# EasyEDA schematic SCH_Satlla_4_rpi_board_2023-01-29.json
TITLE: Solar_Unit_110x50; REV: 1.0; Date: 2021-01-31; Sheet: 1/1; Drawn By: KCG LAB; Company: KCG LAB
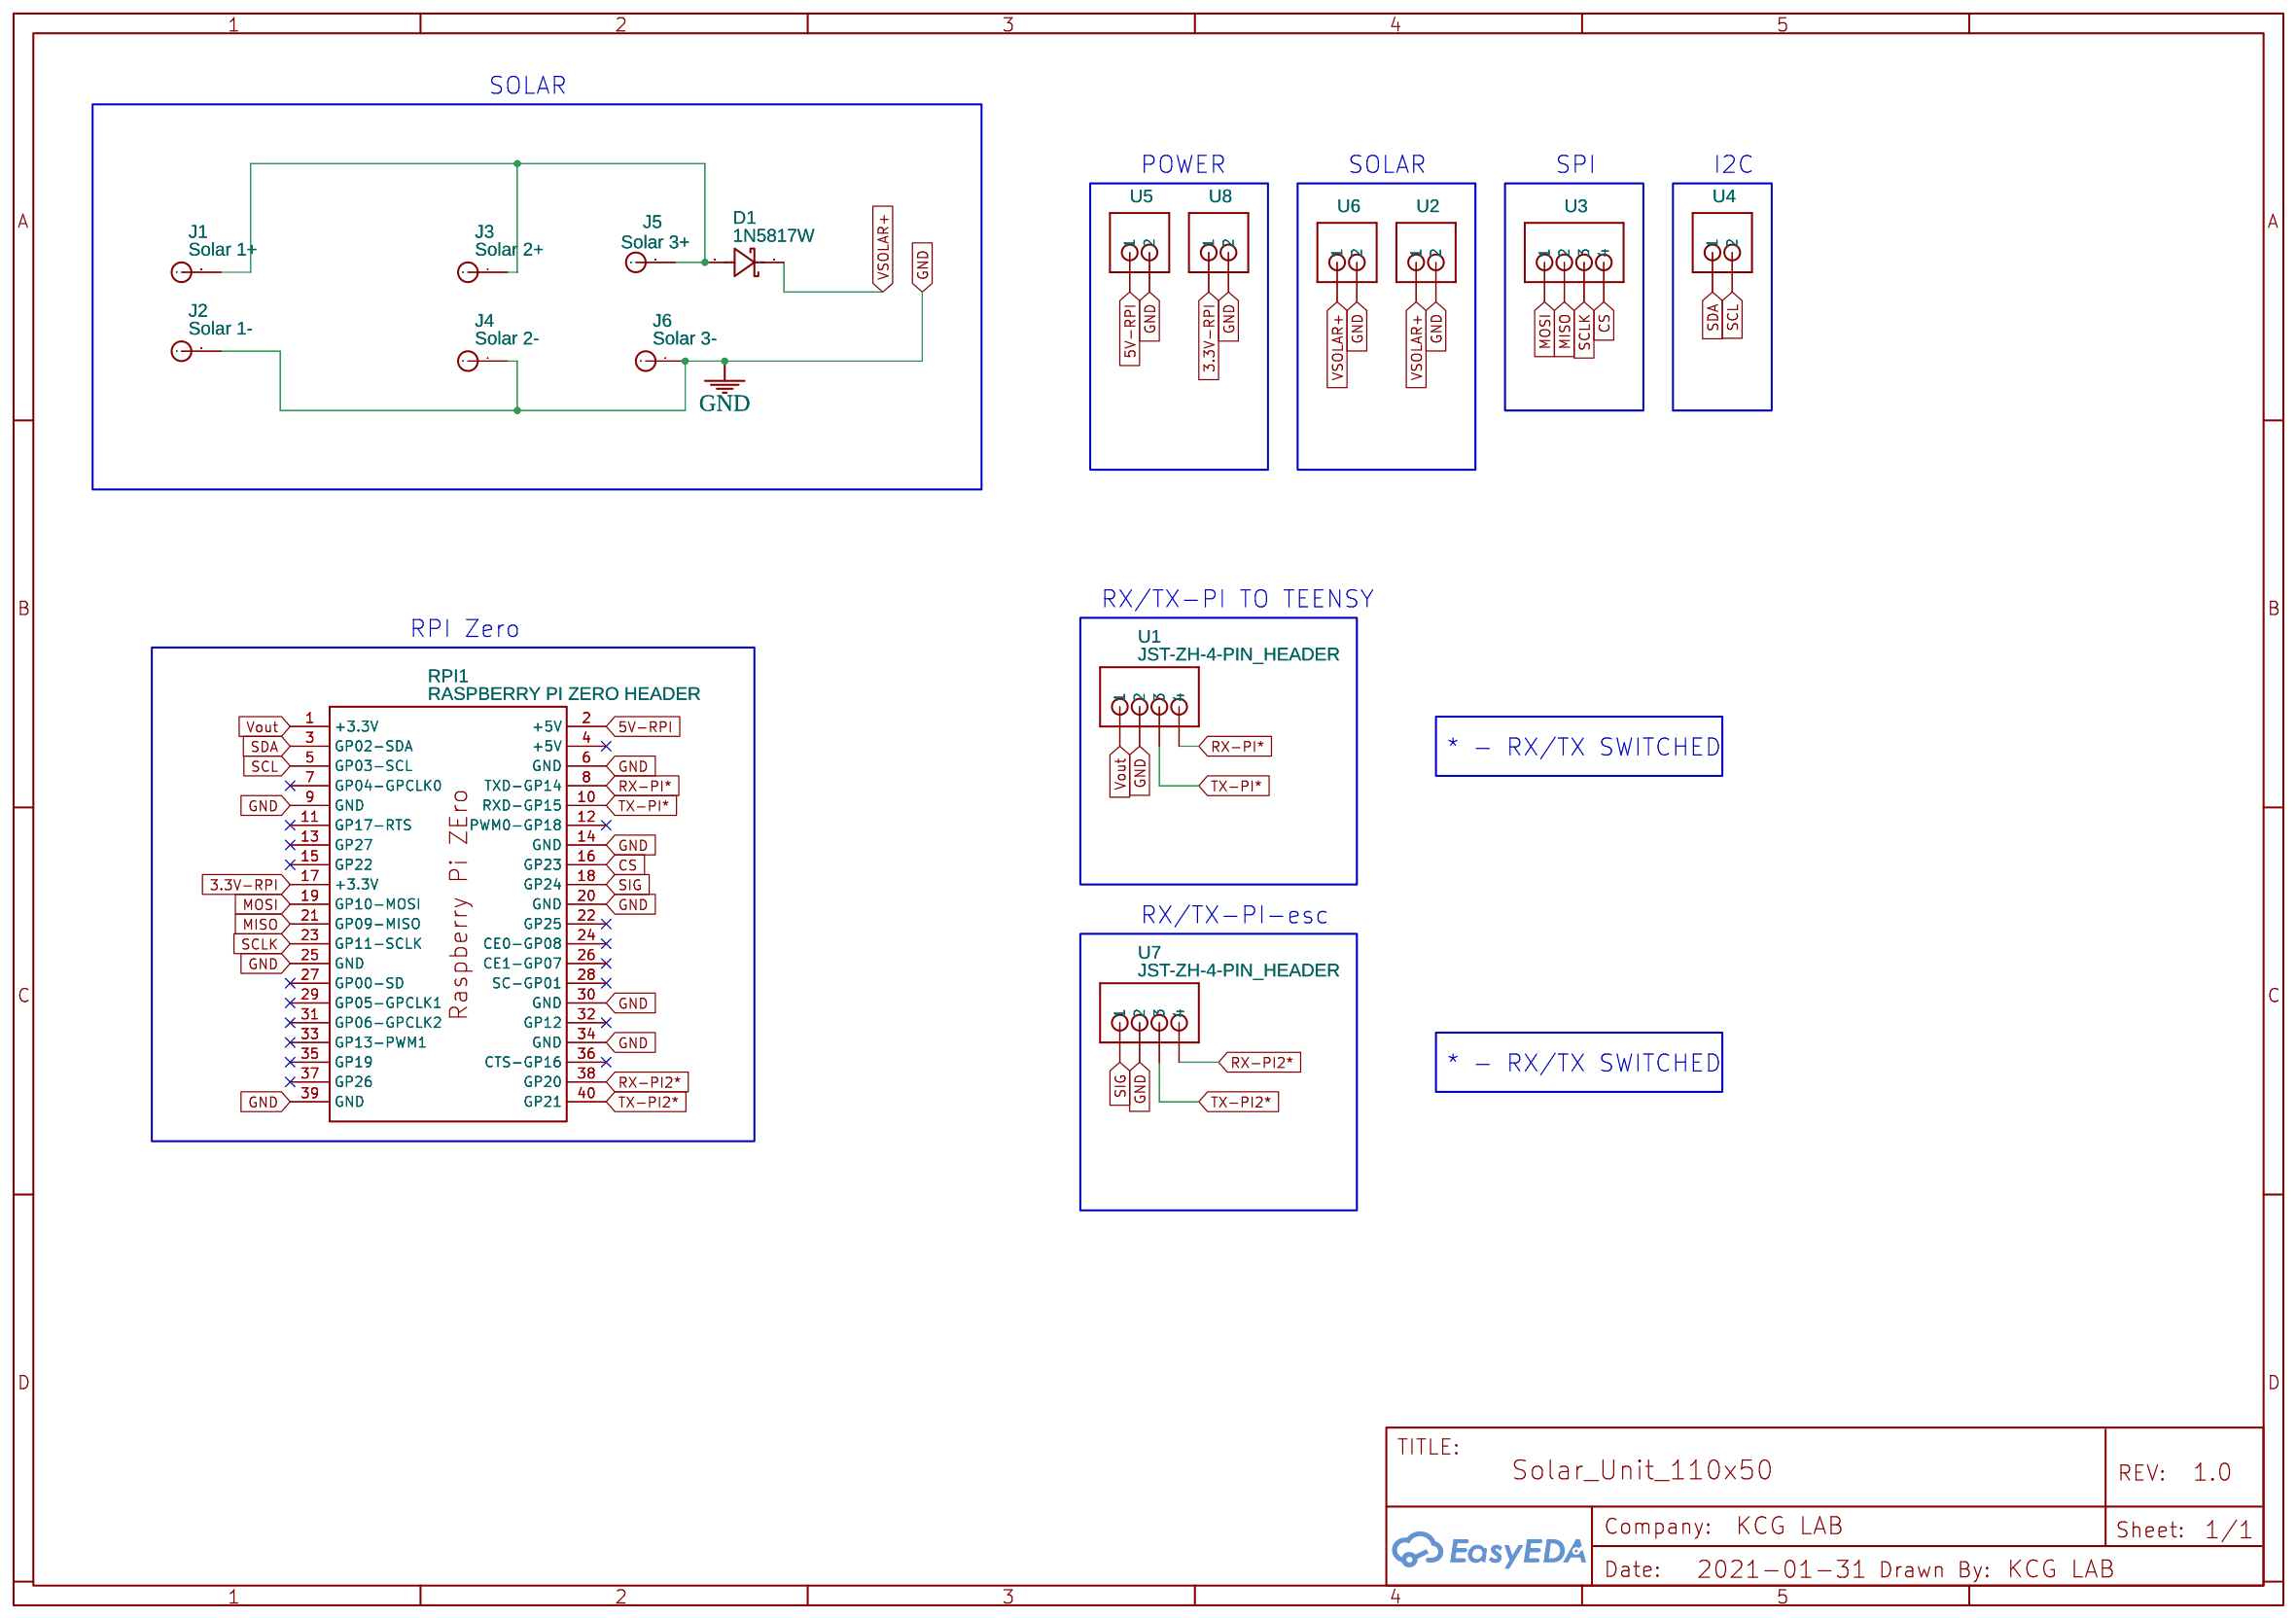
[diagram p0: schematic sheet]

## Parts
D1  1N5817W  [SOD-123_L2.8-W1.8-LS3.7-RD]
J1  Solar 1+  [CONNECTOR]
J2  Solar 1-  [CONNECTOR]
J3  Solar 2+  [CONNECTOR]
J4  Solar 2-  [CONNECTOR]
J5  Solar 3+  [CONNECTOR]
J6  Solar 3-  [CONNECTOR]
RPI1  RASPBERRY PI ZERO HEADER  [RASPBERRY_PI_ZERO HEADER_NEW]
U1  JST-ZH-4-PIN_HEADER  [JST-ZH-4 1.5MM]
U2  JST-ZH-2-PIN_HEADER TH  [JST-ZH-2 1.5MM TH]
U3  JST-ZH-4-PIN_HEADER  [JST-ZH-4 1.5MM]
U4  JST-ZH-2-PIN_HEADER TH  [JST-ZH-2 1.5MM TH]
U5  JST-ZH-2-PIN_HEADER TH  [JST-ZH-2 1.5MM TH]
U6  JST-ZH-2-PIN_HEADER TH  [JST-ZH-2 1.5MM TH]
U7  JST-ZH-4-PIN_HEADER  [JST-ZH-4 1.5MM]
U8  JST-ZH-2-PIN_HEADER TH  [JST-ZH-2 1.5MM TH]

## Library data of the parts
D1 = 1N5817W: Supplier: LCSC; Supplier Part: C727113; Manufacturer: TWGMC; Contributor: LCSC; SMT Type: Extend; JLCPCB SMD: Yes; LCSC Assembly: Yes
J1-J6 = Connector: DIP Black Round Female Header VERT;; Supplier Part: 320030026; Supplier: SeeedStudio; Manufacturer Part: RF130-1013BBS0741; sourceId: kPDdb8uQO; Contributor: Jayadamski
RPI1 = RASPBERRY PI ZERO HEADER: Contributor: TomPilot; sourceId: XYSa4mEWQ; Manufacturer Part: Raspberry Pi Zero WH; Supplier: Pollin; Supplier Part: 810885; Manufacturer: Raspberry Pi Foundation; link: https://www.pollin.de/p/raspberry-pi-zero-wh-mit-bestuecktem-header-810885
U1 U3 U7 = JST-ZH-4-PIN_HEADER
U2 U4-U6 U8 = JST-ZH-2-PIN_HEADER TH: Contributor: Herve Goncalves

## Nets
3.3V-RPI: RPI1.17(+3.3V) U8.1
5V-RPI: RPI1.2(+5V) U5.1
GND: J2.1 J4.1 J6.1 RPI1.6(GND) RPI1.9(GND) RPI1.14(GND) RPI1.20(GND) RPI1.25(GND) RPI1.30(GND) RPI1.34(GND) RPI1.39(GND) U1.P2(2) U2.2 U5.2 U6.2 U7.P2(2) U8.2
CS: RPI1.16(GP23) U3.P4(4)
MISO: RPI1.21(GP09-MISO) U3.P2(2)
MOSI: RPI1.19(GP10-MOSI) U3.P1(1)
RX-PI2*: RPI1.38(GP20) U7.P4(4)
RX-PI*: RPI1.8(TXD-GP14) U1.P4(4)
SCL: RPI1.5(GP03-SCL) U4.2
SCLK: RPI1.23(GP11-SCLK) U3.P3(3)
SDA: RPI1.3(GP02-SDA) U4.1
SIG: RPI1.18(GP24) U7.P1(1)
TX-PI2*: RPI1.40(GP21) U7.P3(3)
TX-PI*: RPI1.10(RXD-GP15) U1.P3(3)
Vout: RPI1.1(+3.3V) U1.P1(1)
VSOLAR+: D1.1(C) U2.1 U6.1
Net-(D1-2): D1.2(A) J1.1 J3.1 J5.1

Not connected (* = marked no-connect by the designer): RPI1 4(+5V)* 7(GP04-GPCLK0)* 11(GP17-RTS)* 12(PWM0-GP18)* 13(GP27)* 15(GP22)* 22(GP25)* 24(CE0-GP08)* 26(CE1-GP07)* 27(GP00-SD)* 28(SC-GP01)* 29(GP05-GPCLK1)* 31(GP06-GPCLK2)* 32(GP12)* 33(GP13-PWM1)* 35(GP19)* 36(CTS-GP16)* 37(GP26)*

## Notes on the sheet
- SOLAR
- POWER
- SOLAR
- SPI
- I2C
- RX/TX-PI TO TEENSY
- RPI Zero
- * - RX/TX SWITCHED
- RX/TX-PI-esc
- * - RX/TX SWITCHED
